# Altium schematic sheet ADC.SchDoc
size B; SheetNumber: 5; SheetTotal: 8
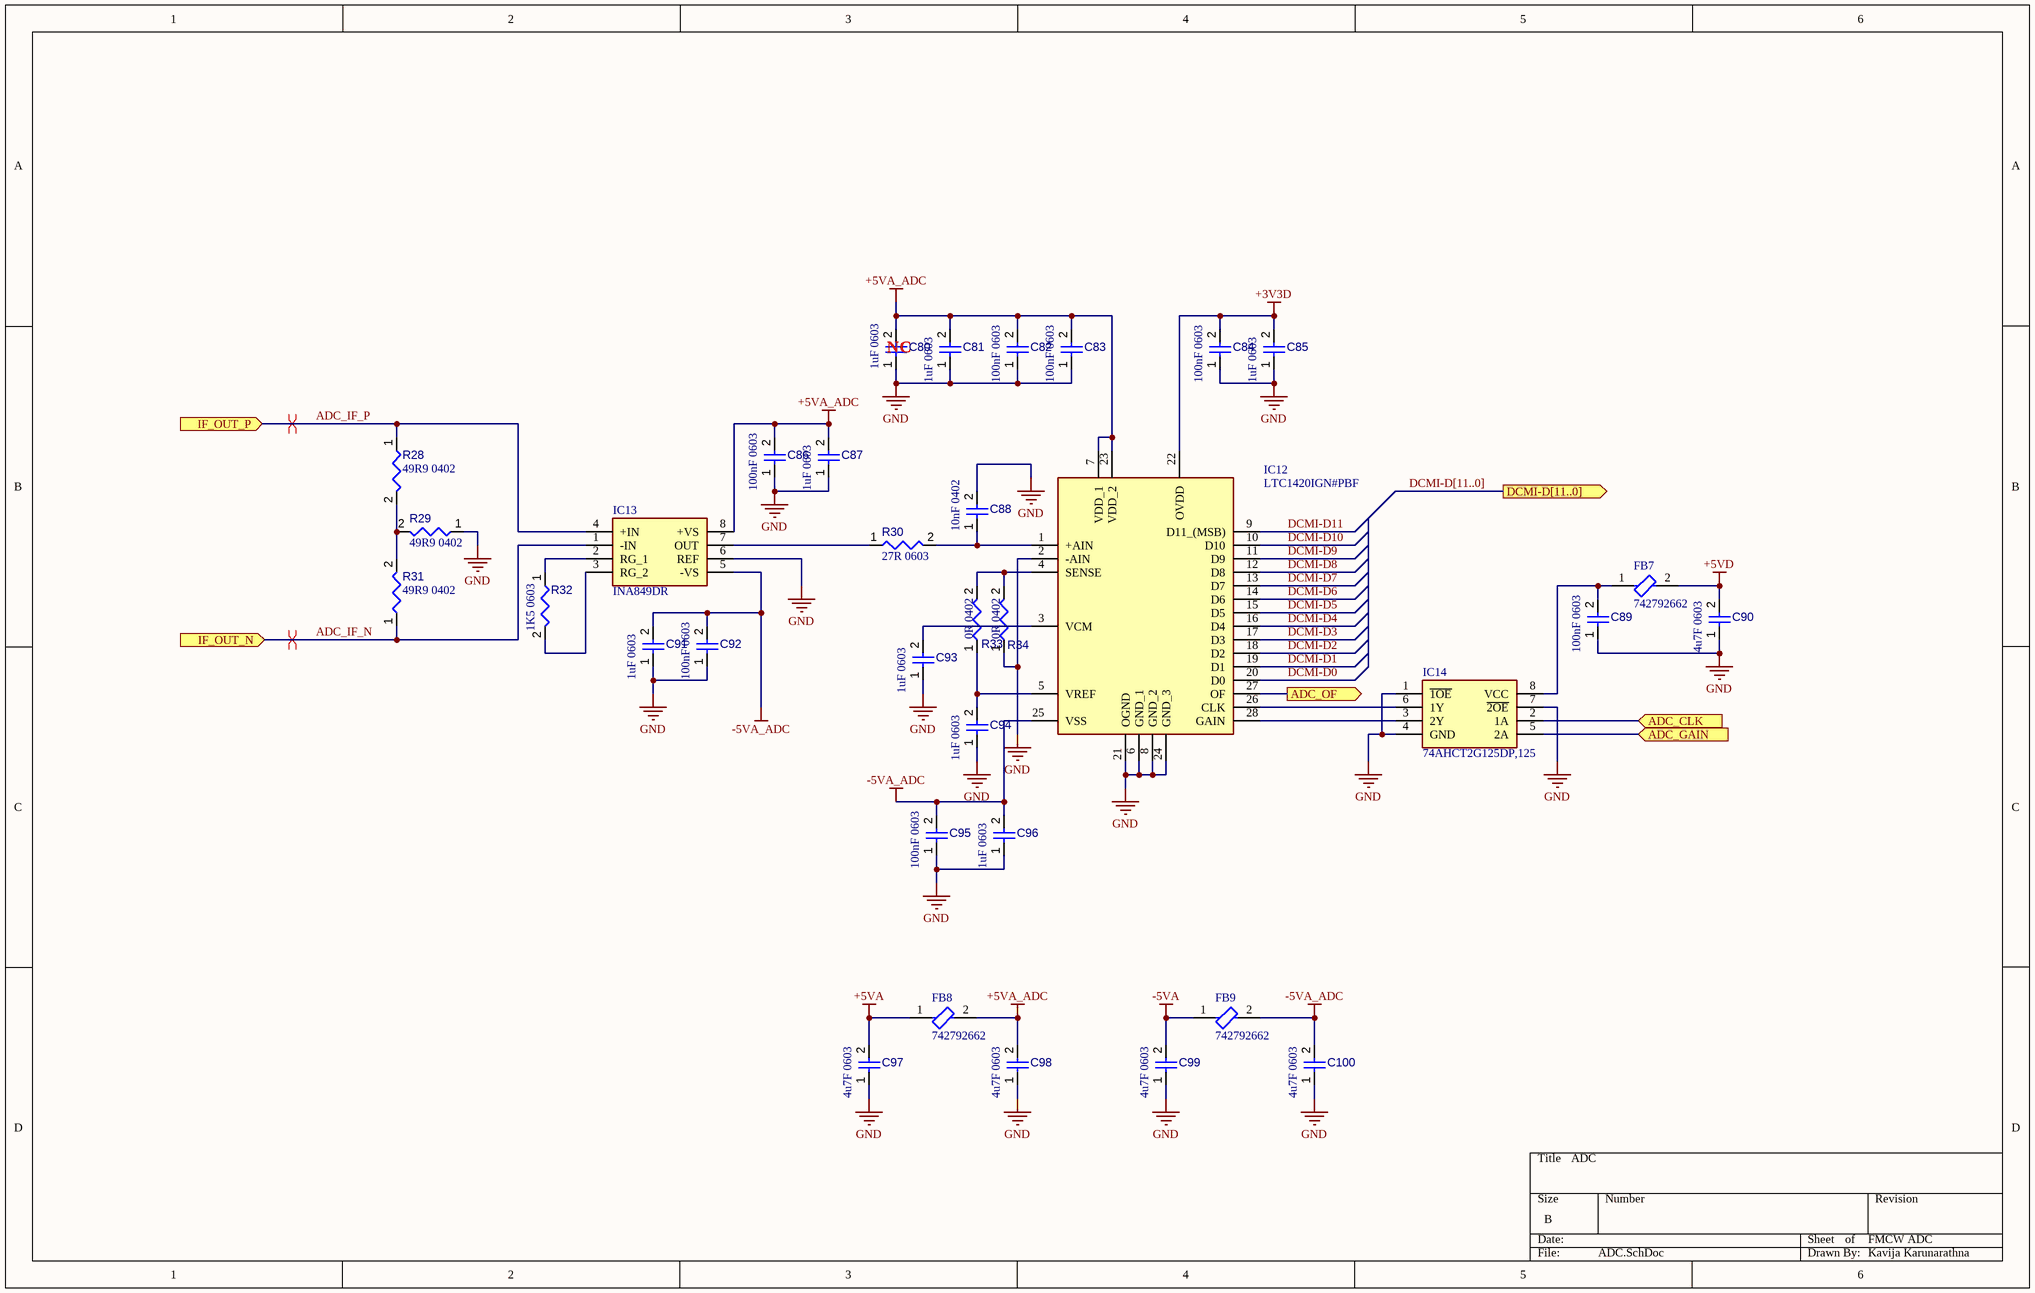
[diagram p0: ADC.SchDoc]

## Parts
C80  value 1uF 0603  [CAPC0603(1608)100_L]  (hidden comment: Capacitor 1µF +/-0.1% 25V 0603)
C81  value 1uF 0603  [CAPC0603(1608)100_L]  (hidden comment: Capacitor 1µF +/-0.1% 25V 0603)
C82  value 100nF 0603  [CAPC0603(1608)100_L]  (hidden comment: Capacitor 1µF +/-0.1% 25V 0603)
C83  value 100nF 0603  [CAPC0603(1608)100_L]  (hidden comment: Capacitor 1µF +/-0.1% 25V 0603)
C84  value 100nF 0603  [CAPC0603(1608)100_L]  (hidden comment: Capacitor 1µF +/-0.1% 25V 0603)
C85  value 1uF 0603  [CAPC0603(1608)100_L]  (hidden comment: Capacitor 1µF +/-0.1% 25V 0603)
C86  value 100nF 0603  [CAPC0603(1608)100_L]  (hidden comment: Capacitor 1µF +/-0.1% 25V 0603)
C87  value 1uF 0603  [CAPC0603(1608)100_L]  (hidden comment: Capacitor 1µF +/-0.1% 25V 0603)
C88  value 10nF 0402  [CAPC0402(1005)60_L]  (hidden comment: Capacitor 47nF +/-20% 50V 0402)
C89  value 100nF 0603  [CAPC0603(1608)100_L]  (hidden comment: Capacitor 1µF +/-0.1% 25V 0603)
C90  value 4u7F 0603  [CAPC0603(1608)100_L]  (hidden comment: Capacitor 1µF +/-0.1% 25V 0603)
C91  value 1uF 0603  [CAPC0603(1608)100_L]  (hidden comment: Capacitor 1µF +/-0.1% 25V 0603)
C92  value 100nF 0603  [CAPC0603(1608)100_L]  (hidden comment: Capacitor 1µF +/-0.1% 25V 0603)
C93  value 1uF 0603  [CAPC0603(1608)100_L]  (hidden comment: Capacitor 1µF +/-0.1% 25V 0603)
C94  value 1uF 0603  [CAPC0603(1608)100_L]  (hidden comment: Capacitor 1µF +/-0.1% 25V 0603)
C95  value 100nF 0603  [CAPC0603(1608)100_L]  (hidden comment: Capacitor 1µF +/-0.1% 25V 0603)
C96  value 1uF 0603  [CAPC0603(1608)100_L]  (hidden comment: Capacitor 1µF +/-0.1% 25V 0603)
C97  value 4u7F 0603  [CAPC0603(1608)100_L]  (hidden comment: Capacitor 1µF +/-0.1% 25V 0603)
C98  value 4u7F 0603  [CAPC0603(1608)100_L]  (hidden comment: Capacitor 1µF +/-0.1% 25V 0603)
C99  value 4u7F 0603  [CAPC0603(1608)100_L]  (hidden comment: Capacitor 1µF +/-0.1% 25V 0603)
C100  value 4u7F 0603  [CAPC0603(1608)100_L]  (hidden comment: Capacitor 1µF +/-0.1% 25V 0603)
FB7  742792662  [FB-0603]
FB8  742792662  [FB-0603]
FB9  742792662  [FB-0603]
IC12  LTC1420IGN#PBF  [SOP64P601X175-28N]
IC13  INA849DR  [SOIC127P600X175-8N]
IC14  74AHCT2G125DP,125  [SOP65P400X110-8N]
R28  value 49R9 0402  [RESC0402(1005)_L]  (hidden comment: 383KR2F)
R29  value 49R9 0402  [RESC0402(1005)_L]  (hidden comment: 383KR2F)
R30  value 27R 0603  [RESC0603(1608)_L]  (hidden comment: 120R3J)
R31  value 49R9 0402  [RESC0402(1005)_L]  (hidden comment: 383KR2F)
R32  value 1K5 0603  [RESC0603(1608)_L]  (hidden comment: 120R3J)
R33  value 0R 0402  [RESC0402(1005)_L]  (hidden comment: 383KR2F)
R34  value 0R 0402  [RESC0402(1005)_L]  (hidden comment: 383KR2F)

## Ports
ADC_CLK (in, see MCU[6B]), ADC_GAIN (in, see MCU[4B]), ADC_OF (out, see MCU[4C]), DCMI-D[11..0] (out, see MCU[6C]), IF_OUT_N (in, see VideoFiltering[6C]), IF_OUT_P (in, see VideoFiltering[6B])

## Nets
+3V3D: C84.2 C85.2 IC12.22(OVDD)
+5VA: C97.2 FB8.1
+5VA_ADC: C80.2 C81.2 C82.2 C83.2 C86.2 C87.2 C98.2 FB8.2 IC12.7(VDD_1) IC12.23(VDD_2) IC13.8(+VS)
+5VD: C90.2 FB7.2
-5VA: C99.2 FB9.1
-5VA_ADC: C91.2 C92.2 C95.2 C96.2 C100.2 FB9.2 IC12.25(VSS) IC13.5(-VS)
GND: C80.1 C81.1 C82.1 C83.1 C84.1 C85.1 C86.1 C87.1 C88.2 C89.1 C90.1 C91.1 C92.1 C93.1 C94.1 C95.1 C96.1 C97.1 C98.1 C99.1 C100.1 IC12.2(-AIN) IC12.6(GND_1) IC12.8(GND_2) IC12.21(OGND) IC12.24(GND_3) IC13.6(REF) IC14.1(~{1OE}) IC14.4(GND) IC14.7(~{2OE}) R29.1 R34.1
ADC_CLK: IC14.2(1A) ; port ADC_CLK
ADC_GAIN: IC14.5(2A) ; port ADC_GAIN
ADC_IF_N: IC13.1(-IN) R31.1 ; port IF_OUT_N
ADC_IF_P: IC13.4(+IN) R28.1 ; port IF_OUT_P
ADC_OF: IC12.27(OF) ; port ADC_OF
DCMI-D0: IC12.20(D0)
DCMI-D1: IC12.19(D1)
DCMI-D2: IC12.18(D2)
DCMI-D3: IC12.17(D3)
DCMI-D4: IC12.16(D4)
DCMI-D5: IC12.15(D5)
DCMI-D6: IC12.14(D6)
DCMI-D7: IC12.13(D7)
DCMI-D8: IC12.12(D8)
DCMI-D9: IC12.11(D9)
DCMI-D10: IC12.10(D10)
DCMI-D11: IC12.9(D11_(MSB))
NetC88_1: C88.1 IC12.1(+AIN) R30.2
NetC89_2: C89.2 FB7.1 IC14.8(VCC)
NetC93_2: C93.2 IC12.3(VCM)
NetC94_2: C94.2 IC12.5(VREF) R33.1
NetIC12_4: IC12.4(SENSE) R33.2 R34.2
NetIC12_26: IC12.26(CLK) IC14.6(1Y)
NetIC12_28: IC12.28(GAIN) IC14.3(2Y)
NetIC13_2: IC13.2(RG_1) R32.1
NetIC13_3: IC13.3(RG_2) R32.2
NetIC13_7: IC13.7(OUT) R30.1
NetR28_2: R28.2 R29.2 R31.2

## Buses and harness runs
bus DCMI-D[11..0] = port DCMI-D[11..0]

## Layout directives
differential pair: ADC_IF_N, ADC_IF_P

## Notes on the sheet
- (near C80) NC
- ADC
- FMCW ADC
- Kavija Karunarathna

## Library data of the parts
C80 C81 C85 C87 C91 C93 C94 C96 = CMP-001-00055-4: Chip Capacitor, 1µF +/-0.1%, 25V, 0603, Thickness 1 mm; Manufacturer Part No: 0603YC105KAZ2A; Tolerance: 20%; Min Operating Temperature: -55°C; Max Operating Temperature: 85°C; Voltage Rating: 25V; Mounting Technology: SMT; Case/Package: 0603; Pins: 2; Mouser Part No: 581-0603YC105KAZ2A
C82-C84 C86 C89 C92 C95 = CMP-001-00055-4: Chip Capacitor, 1µF +/-0.1%, 25V, 0603, Thickness 1 mm; Manufacturer Part No: 0603X104K250CT; Tolerance: 20%; Min Operating Temperature: -55°C; Max Operating Temperature: 85°C; Voltage Rating: 25V; Mounting Technology: SMT; Case/Package: 0603; Pins: 2; Mouser Part No: 791-0603X104K250CT
C88 = CMP-001-00071-4: Multilayer Ceramic Capacitors MLCC - SMD/SMT 50 V 10 pF C0G 0402 1%; Manufacturer Part No: VJ0402Y103JXJAC; Tolerance: 20%; Pins: 2; Mounting Technology: SMT; Voltage Rating: 50V; Case/Package: 0402; Max Operating Temperature: 85°C; Min Operating Temperature: -55°C; Mouser Part No: 77-VJ0402Y103JXJAC
C90 C97-C100 = CMP-001-00055-4: Chip Capacitor, 1µF +/-0.1%, 25V, 0603, Thickness 1 mm; Manufacturer Part No: 06033D475KAT2A; Tolerance: 20%; Min Operating Temperature: -55°C; Max Operating Temperature: 85°C; Voltage Rating: 25V; Mounting Technology: SMT; Case/Package: 0603; Pins: 2; Mouser Part No: 581-06033D475KAT2A
FB7-FB9 = 742792662-FB: FERRITE BEAD 0603; Max Current Rating: 600mA; DC Resistance (DCR): 1000Ohm; Number of Lines: 1; Case/Package: 0603; Mount: Surface Mount; Case Code (Imperial): 0603; Packaging: Cut Tape; Max Operating Temperature: 125°C; Min Operating Temperature: -55°C; Manufacturer Part No: 742792662; Mouser Part No: 710-742792662
IC12 = LTC1420IGN#PBF: Integrated Circuit; Manufacturer_Name: Analog Devices; Datasheet Link: http://www.linear.com/docs/1071; Height: 1.75mm; Manufacturer Part No: LTC1420IGN#PBF; Mouser Part No: 584-LTC1420IGN#PBF; Mouser Price/Stock: https://www.mouser.com/Search/Refine.aspx?Keyword=584-LTC1420IGN%23PBF; Arrow Part Number: LTC1420IGN#PBF; Arrow Price/Stock: https://www.arrow.com/en/products/ltc1420ignpbf/linear-technology
IC13 = INA849DR: Integrated Circuit; Manufacturer_Name: Texas Instruments; Datasheet Link: https://www.ti.com/lit/ds/symlink/ina849.pdf?ts=1609495728489&ref_url=https%253A%252F%252Fwww.ti.com%252Fproduct%252FINA849; Height: 1.75mm; Manufacturer Part No: INA849DR; Mouser Part No: 595-INA849DR; Mouser Price/Stock: https://www.mouser.co.uk/ProductDetail/Texas-Instruments/INA849DR?qs=eP2BKZSCXI4qgDpsz1tg9g%3D%3D; Arrow Part Number: INA849DR; Arrow Price/Stock: https://www.arrow.com/en/products/ina849dr/texas-instruments?utm_currency=USD&region=europe
IC14 = 74AHCT2G125DP,125: Integrated Circuit; Manufacturer_Name: Nexperia; Datasheet Link: https://assets.nexperia.com/documents/data-sheet/74AHC_AHCT2G125.pdf; Height: 1.1mm; Mouser Price/Stock: https://www.mouser.co.uk/ProductDetail/Nexperia/74AHCT2G125DP125?qs=P62ublwmbi%2FS7fXZumeLoQ%3D%3D; Arrow Part Number: 74AHCT2G125DP,125; Arrow Price/Stock: https://www.arrow.com/en/products/74ahct2g125dp125/nexperia; Manufacturer Part No: 74AHCT2G125DP,125; Mouser Part No: 771-AHCT2G125DP125
R28 R29 R31 = CMP-009-00097-2: Thin Film Resistors - SMD 49.9 OHM .1% 50PPM 1/16W; Manufacturer Part No: RT0402BRE0749R9L; Tolerance: 1%; Power: 100mW; Case/Package: 0402; Mounting Technology: SMT; Pins: 2; Mouser Part No: 603-RT0402BRE0749R9L
R30 = CMP-009-00069-2: Thick Film Resistors - SMD General Purpose Chip Resistor 0603, 200Ohms, 1%, 1/10W; Manufacturer Part No: RT0603BRD0727RL; Power: 100mW; Tolerance: 5%; Mounting Technology: SMT; Case/Package: 0603; Pins: 2; Mouser Part No: 603-RT0603BRD0727RL
R32 = CMP-009-00069-2: Thick Film Resistors - SMD WRIS-RSKS 100 Ohms 1 % 0.1 W 0603 AEC-Q200; Manufacturer Part No: CR0603-JW-152ELF; Power: 100mW; Tolerance: 5%; Mounting Technology: SMT; Case/Package: 0603; Pins: 2; Mouser Part No: 652-CR0603-JW-152ELF
R33 R34 = CMP-009-00097-2: Thick Film Resistors - SMD 0 Ohms 1/16 W 50 V 5 % 0402 - 55 C / + 155 C AEC-Q200; Manufacturer Part No: AC0402JR-7D0RL; Tolerance: 1%; Power: 100mW; Case/Package: 0402; Mounting Technology: SMT; Pins: 2; Mouser Part No: 603-AC0402JR-7D0RL